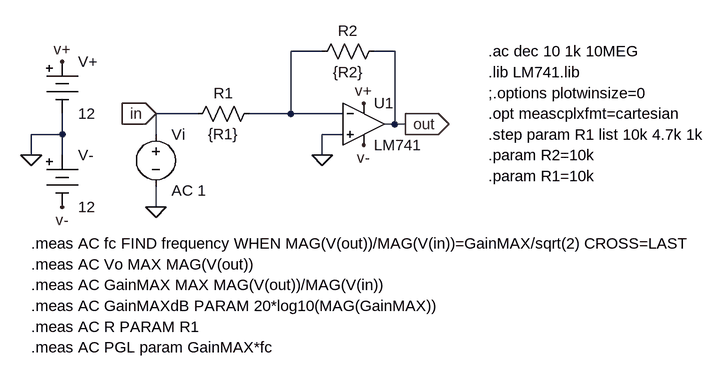
[diagram p0: schematic lab2.asc]
lab2.asc, the LTspice schematic file:
Version 4.1
SHEET 1 2320 680
WIRE 656 64 608 64
WIRE 768 64 736 64
WIRE 464 160 400 160
WIRE 608 160 608 64
WIRE 608 160 544 160
WIRE 688 160 608 160
WIRE 768 176 768 64
WIRE 768 176 752 176
WIRE 784 176 768 176
WIRE 256 192 256 160
WIRE 256 192 208 192
WIRE 400 192 400 160
WIRE 688 192 656 192
WIRE 208 224 208 192
WIRE 256 224 256 192
WIRE 656 224 656 192
WIRE 400 304 400 272
FLAG 208 224 0
FLAG 784 176 out
IOPIN 784 176 Out
FLAG 256 80 v+
FLAG 256 304 v-
FLAG 720 144 v+
FLAG 720 208 v-
FLAG 400 160 in
IOPIN 400 160 In
FLAG 656 224 0
FLAG 400 304 0
SYMBOL Misc\\battery 256 208 R0
SYMATTR InstName V-
SYMATTR Value 12
SYMBOL Misc\\battery 256 64 R0
SYMATTR InstName V+
SYMATTR Value 12
SYMBOL voltage 400 176 R0
WINDOW 3 24 130 Invisible 2
WINDOW 123 24 102 Left 2
WINDOW 39 0 0 Left 0
SYMATTR Value SINE(0 1 1MEG)
SYMATTR Value2 AC 1
SYMATTR InstName Vi
SYMBOL res 560 144 R90
WINDOW 0 0 56 VBottom 2
WINDOW 3 32 56 VTop 2
SYMATTR InstName R1
SYMATTR Value {R1}
SYMBOL res 640 80 R270
WINDOW 0 32 56 VTop 2
WINDOW 3 0 56 VBottom 2
SYMATTR InstName R2
SYMATTR Value {R2}
SYMBOL OpAmps\\LM741 720 112 R0
SYMATTR InstName U1
TEXT 912 96 Left 2 !.lib LM741.lib
TEXT 912 64 Left 2 !.ac dec 10 1k 10MEG
TEXT 912 128 Left 2 !;.options plotwinsize=0
TEXT 912 160 Left 2 !.opt meascplxfmt=cartesian
TEXT 208 392 Left 2 !.meas AC Vo MAX MAG(V(out))
TEXT 208 360 Left 2 !.meas AC fc FIND frequency WHEN MAG(V(out))/MAG(V(in))=GainMAX/sqrt(2) CROSS=LAST
TEXT 208 424 Left 2 !.meas AC GainMAX MAX MAG(V(out))/MAG(V(in))
TEXT 208 456 Left 2 !.meas AC GainMAXdB PARAM 20*log10(MAG(GainMAX))
TEXT 912 192 Left 2 !.step param R1 list 10k 4.7k 1k
TEXT 912 224 Left 2 !.param R2=10k
TEXT 912 256 Left 2 !.param R1=10k
TEXT 208 488 Left 2 !.meas AC R PARAM R1
TEXT 208 520 Left 2 !.meas AC PGL param GainMAX*fc

The netlist it stands for:
* lab2.asc
V- 0 v- 12
V+ v+ 0 12
Vi in 0 SINE(0 1 1MEG) AC 1
R1 N001 in {R1}
R2 N001 out {R2}
X§U1 0 N001 v+ v- out LM741  ; pins In+ In- V+ V- OUT
.lib LM741.lib
.ac dec 10 1k 10MEG
;.options plotwinsize=0
.opt meascplxfmt=cartesian
.meas AC Vo MAX MAG(V(out))
.meas AC fc FIND frequency WHEN MAG(V(out))/MAG(V(in))=GainMAX/sqrt(2) CROSS=LAST
.meas AC GainMAX MAX MAG(V(out))/MAG(V(in))
.meas AC GainMAXdB PARAM 20*log10(MAG(GainMAX))
.step param R1 list 10k 4.7k 1k
.param R2=10k
.param R1=10k
.meas AC R PARAM R1
.meas AC PGL param GainMAX*fc
.lib LM741.lib
.backanno
.end